# Altium schematic sheet IDCI_WifiNode_PER.SchDoc: WifiNode_PER
size A4; Author: Luciano Lopez; CompanyName: UTN-FRBA; Revision: 1; SheetNumber: 5; SheetTotal: 5
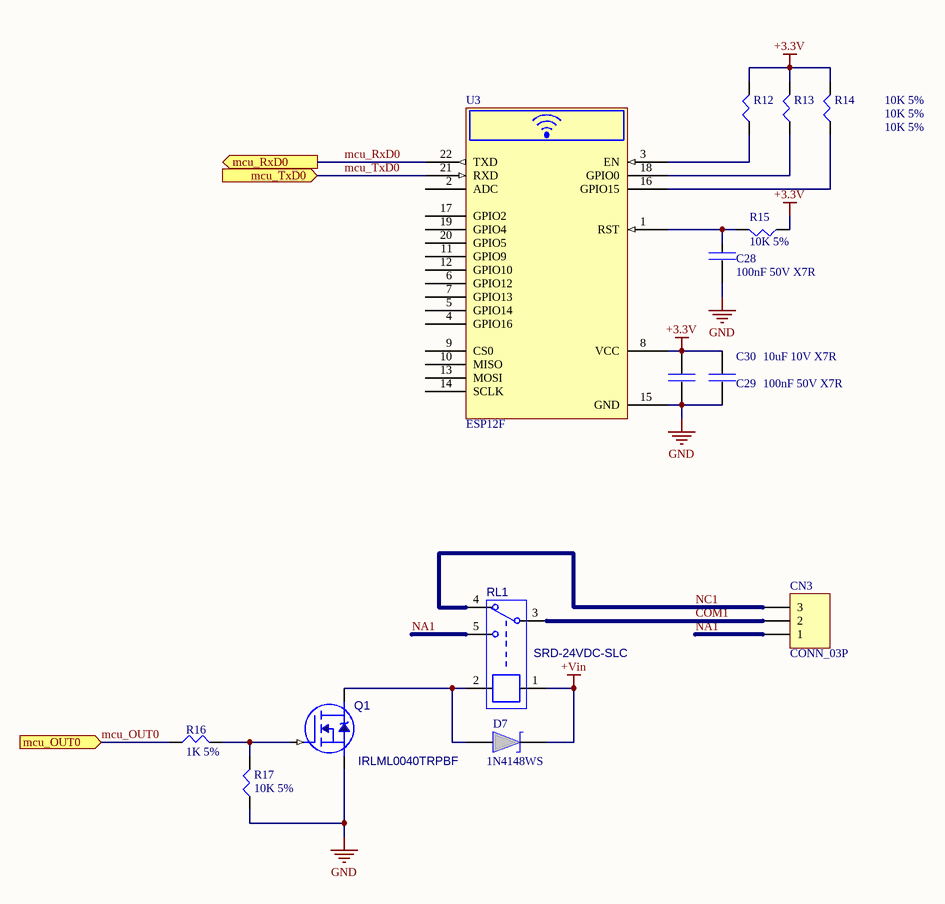
[diagram p0: IDCI_WifiNode_PER.SchDoc]

## Parts
C28  100nF 50V X7R  [C_0805]
C29  100nF 50V X7R  [C_0805]
C30  10uF 10V X7R  [C_0805]
CN3  CONN_03P  [TERMINAL_BLOCK_3_POLES]
D7  1N4148WS  [Diode_SOD-323]
Q1  IRLML0040TRPBF  [IC_SOT-23]
R12  10K 5%  [R_0805]
R13  10K 5%  [R_0805]
R14  10K 5%  [R_0805]
R15  10K 5%  [R_0805]
R16  1K 5%  [R_0805]
R17  10K 5%  [R_0805]
RL1  SRD-24VDC-SLC  [RELAY]
U3  ESP12F  [ESP12F]

## Ports
mcu_OUT0 (in), mcu_RxD0 (out), mcu_TxD0 (in)

## Nets
+3.3V: C29.2 C30.2 R12.2 R13.2 R14.2 R15.1 U3.8(VCC)
+Vin: D7.2 RL1.1
GND: C28.1 C29.1 C30.1 Q1.2(SOURCE) R17.1 U3.15(GND)
COM1: CN3.2 RL1.3
mcu_OUT0: R16.1 ; port mcu_OUT0
mcu_RxD0: U3.22(TXD) ; port mcu_RxD0
mcu_TxD0: U3.21(RXD) ; port mcu_TxD0
NA1: CN3.1 RL1.5
NC1: CN3.3 RL1.4
NetC28_2: C28.2 R15.2 U3.1(RST)
NetD7_1: D7.1 Q1.3(DRAIN) RL1.2
NetQ1_1: Q1.1(GATE) R16.2 R17.2
NetR12_1: R12.1 U3.3(EN)
NetR13_1: R13.1 U3.18(GPIO0)
NetR14_1: R14.1 U3.16(GPIO15)

Not connected (* = marked no-connect by the designer): U3 2(ADC) 4(GPIO16) 5(GPIO14) 6(GPIO12) 7(GPIO13) 9(CS0) 10(MISO) 11(GPIO9) 12(GPIO10) 13(MOSI) 14(SCLK) 17(GPIO2) 19(GPIO4) 20(GPIO5)

## Notes on the sheet
- Title:
- Size:
- Author:
- A4
- Sheet
- of
- Revision:
- File:
- Date:

## Library data of the parts
C28-C30 = CAPACITOR: 100nF x 50v
CN3 = CONN_03P: Connector Generic 3 Vias
D7 = TVS_DIODE
Q1 = N_MOSFET_SOT23: Mosfet N-Ch
R12-R17 = Resistor
RL1 = RELAY SPDT
U3 = ESP12F Wifi Module: Wifi Module